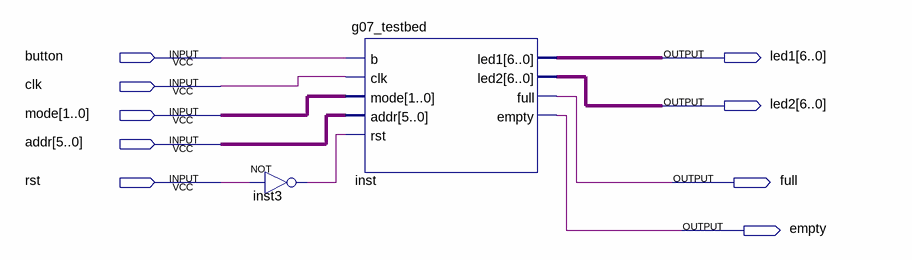
[diagram p0: schematic sheet]
// Quartus schematic g07_testbed_diagram.bdf as structural Verilog: 2 symbols, 9 pins
module g07_testbed_diagram (
  input  button,
  input  clk,
  input  [1:0] mode,
  input  [5:0] addr,
  input  rst,
  output [6:0] led1,
  output [6:0] led2,
  output full,
  output empty
);

  wire inst3_out;

  not inst3 (inst3_out, rst);
  g07_testbed inst (
    .b(button), .clk(clk), .mode(mode), .addr(addr), .rst(inst3_out), .led1(led1), .led2(led2), .full(full),
    .empty(empty));
endmodule
